# EAGLE design EC-TDS-PPM_V2-1 (EAGLE 7.5.0)
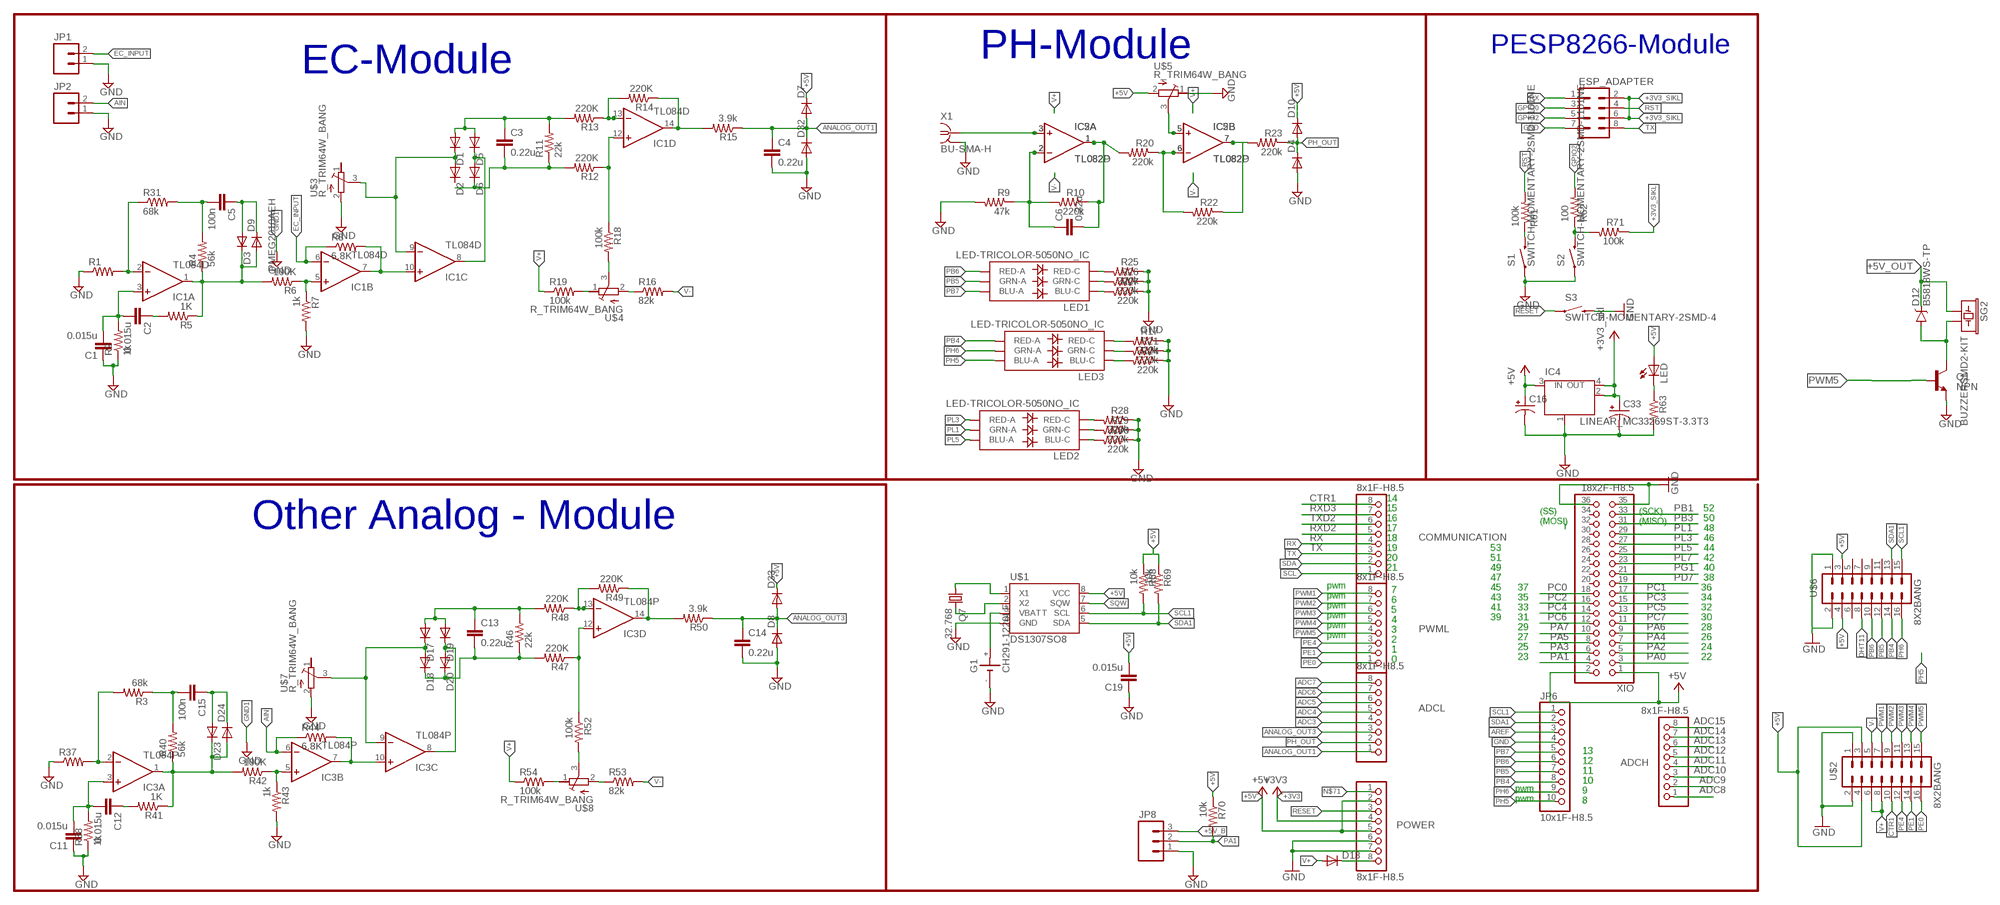
[diagram p0: schematic, sheet 1]

## Parts
ADCH  8x1F-H8.5  PINHD-1X8  [1X08]
ADCL  8x1F-H8.5  PINHD-1X8  [1X08]
C1  0.015u  C-EUC0603  [C0603]
C2  0.015u  C-EUC0603  [C0603]
C3  0.22u  C-EUC0603  [C0603]
C4  0.22u  C-EUC0603  [C0603]
C5  100n  C-EUC0603  [C0603]
C6  0.22u  C-EUC0603  [C0603]
C11  0.015u  C-EUC0603  [C0603]
C12  0.015u  C-EUC0603  [C0603]
C13  0.22u  C-EUC0603  [C0603]
C14  0.22u  C-EUC0603  [C0603]
C15  100n  C-EUC0603  [C0603]
C16  CPOL-USSMCC  [SMC_C]
C19  0.015u  C-EUC0603  [C0603]
C33  CPOL-USSMCC  [SMC_C]
COMMUNICATION  8x1F-H8.5  PINHD-1X8  [1X08]
D1  PMEG2010AEH  DIOD_SOT123F  [SOT123F]
D2  PMEG2010AEH  DIOD_SOT123F  [SOT123F]
D3  PMEG2010AEH  DIOD_SOT123F  [SOT123F]
D4  PMEG2010AEH  DIOD_SOT123F  [SOT123F]
D5  PMEG2010AEH  DIOD_SOT123F  [SOT123F]
D6  PMEG2010AEH  DIOD_SOT123F  [SOT123F]
D7  PMEG2010AEH  DIOD_SOT123F  [SOT123F]
D8  PMEG2010AEH  DIOD_SOT123F  [SOT123F]
D9  PMEG2010AEH  DIOD_SOT123F  [SOT123F]
D10  PMEG2010AEH  DIOD_SOT123F  [SOT123F]
D12  B5818WS-TP  DIODE-SCHOTTKY-BAT20J  [SOD-323]
D13  PMEG2010AEH  DIOD_SOT123F  [SOT123F]
D17  PMEG2010AEH  DIOD_SOT123F  [SOT123F]
D18  PMEG2010AEH  DIOD_SOT123F  [SOT123F]
D19  PMEG2010AEH  DIOD_SOT123F  [SOT123F]
D20  PMEG2010AEH  DIOD_SOT123F  [SOT123F]
D23  PMEG2010AEH  DIOD_SOT123F  [SOT123F]
D24  PMEG2010AEH  DIOD_SOT123F  [SOT123F]
D32  PMEG2010AEH  DIOD_SOT123F  [SOT123F]
D33  PMEG2010AEH  DIOD_SOT123F  [SOT123F]
ESP_ADAPTER  M04X2  [2X4]
G1  CH291-1220LF  [CH291-1220LF]
IC1  TL084D  [SO14]
IC2  TL082P  [DIL08]
IC3  TL084P  [DIL14]
IC4  LINEAR_MC33269ST-3.3T3  [LINEAR_SOT223]
IC5  TL082D  [SO08]
JP1  M025MM  [SCREWTERMINAL-5MM-2]
JP2  M025MM  [SCREWTERMINAL-5MM-2]
JP6  10x1F-H8.5  PINHD-1X10_ARD  [1X10]
JP8  M03PTH  [1X03]
LED  SPARKFUN_LED0603  [SPARKFUN_LED-0603]
LED1  LED-TRICOLOR-5050NO_IC  [LED-TRICOLOR-5050]
LED2  LED-TRICOLOR-5050NO_IC  [LED-TRICOLOR-5050]
LED3  LED-TRICOLOR-5050NO_IC  [LED-TRICOLOR-5050]
POWER  8x1F-H8.5  PINHD-1X8  [1X08]
PWML  8x1F-H8.5  PINHD-1X8  [1X08]
Q1  NPN  TRANSISTOR_NPNSOT23-3  [SOT23-3]
Q7  32.768  CRYTALTC38H  [TC38H]
R1  R-US_R0603  [R0603]
R2  1k  R-US_R0603  [R0603]
R3  68k  R-US_R0603  [R0603]
R4  56k  R-US_R0603  [R0603]
R5  1K  R-US_R0603  [R0603]
R6  100K  R-US_R0603  [R0603]
R7  1k  R-US_R0603  [R0603]
R8  6.8K  R-US_R0603  [R0603]
R9  47k  R-US_R0603  [R0603]
R10  220k  R-US_R0603  [R0603]
R11  22k  R-US_R0603  [R0603]
R12  220K  R-US_R0603  [R0603]
R13  220K  R-US_R0603  [R0603]
R14  220K  R-US_R0603  [R0603]
R15  3.9k  R-US_R0603  [R0603]
R16  82k  R-US_R0603  [R0603]
R17  220k  R-US_R0603  [R0603]
R18  100k  R-US_R0603  [R0603]
R19  100k  R-US_R0603  [R0603]
R20  220k  R-US_R0603  [R0603]
R21  220k  R-US_R0603  [R0603]
R22  220k  R-US_R0603  [R0603]
R23  220k  R-US_R0603  [R0603]
R24  220k  R-US_R0603  [R0603]
R25  220k  R-US_R0603  [R0603]
R26  220k  R-US_R0603  [R0603]
R27  220k  R-US_R0603  [R0603]
R28  220k  R-US_R0603  [R0603]
R29  220k  R-US_R0603  [R0603]
R30  220k  R-US_R0603  [R0603]
R31  68k  R-US_R0603  [R0603]
R37  R-US_R0603  [R0603]
R38  1k  R-US_R0603  [R0603]
R40  56k  R-US_R0603  [R0603]
R41  1K  R-US_R0603  [R0603]
R42  100K  R-US_R0603  [R0603]
R43  1k  R-US_R0603  [R0603]
R44  6.8K  R-US_R0603  [R0603]
R46  22k  R-US_R0603  [R0603]
R47  220K  R-US_R0603  [R0603]
R48  220K  R-US_R0603  [R0603]
R49  220K  R-US_R0603  [R0603]
R50  3.9k  R-US_R0603  [R0603]
R52  100k  R-US_R0603  [R0603]
R53  82k  R-US_R0603  [R0603]
R54  100k  R-US_R0603  [R0603]
R61  100k  R-US_R0603  [R0603]
R62  100  R-US_R0603  [R0603]
R63  SPARKFUN_RESISTOR0603-RES  [SPARKFUN_0603-RES]
R68  10k  R-US_R0603  [R0603]
R69  10k  R-US_R0603  [R0603]
R70  10k  R-US_R0603  [R0603]
R71  100k  R-US_R0603  [R0603]
S1  SWITCH-MOMENTARY-2SMD-1101NE  [TACTILE-SWITCH-1101NE]
S2  SWITCH-MOMENTARY-2SMD-1101NE  [TACTILE-SWITCH-1101NE]
S3  SWITCH-MOMENTARY-2SMD-4  [TACTILE_SWITCH_TALL]
SG2  BUZZERSMD2-KIT  [BUZZER-CCV-KIT]
U$1  DS1307SO8  [SO08]
U$2  8X2BANG  [8X2BANG]
U$3  R_TRIM64W_BANG  [RTRIM64W_BANG]
U$4  R_TRIM64W_BANG  [RTRIM64W_BANG]
U$5  R_TRIM64W_BANG  [RTRIM64W_BANG]
U$6  8X2BANG  [8X2BANG]
U$7  R_TRIM64W_BANG  [RTRIM64W_BANG]
U$8  R_TRIM64W_BANG  [RTRIM64W_BANG]
X1  BU-SMA-H  [BU-SMA-H]
XIO  18x2F-H8.5  PINHD-2X18  [2X18]

## Nets
+3V3: POWER.4
+3V3_SIKL: C33.+ ESP_ADAPTER.2 ESP_ADAPTER.6 IC4.2(OUT) IC4.4(OUT) R71.1 ; supply symbol labelled +3V3_sikl
+5V: C16.+ C19.2 D7.C D10.C D33.C IC4.3(IN) LED.A POWER.2 POWER.5 R68.1 R69.1 R70.1 U$1.8(VCC) U$2.3 U$2.4 U$5.2(E) U$6.3 U$6.4
+5V_B: JP8.3 XIO.1 XIO.2 ; supply symbol labelled +5V
+5V_OUT: D12.C SG2.+
ADC3: ADCL.4
ADC4: ADCL.5
ADC5: ADCL.6
ADC6: ADCL.7
ADC7: ADCL.8
ADC8: ADCH.1
ADC9: ADCH.2
ADC10: ADCH.3
ADC11: ADCH.4
ADC12: ADCH.5
ADC13: ADCH.6
ADC14: ADCH.7
ADC15: ADCH.8
AIN: IC3.6(B:-IN) JP2.2 R44.1
ANALOG_OUT1: ADCL.1 C4.1 D7.A D32.C R15.1
ANALOG_OUT3: ADCL.3 C14.1 D8.C D33.A R50.1
AREF: JP6.3
CTR1: COMMUNICATION.8 U$2.10
DHT11: U$6.8
EC_INPUT: IC1.6(B:-IN) JP1.2 R8.1
GND: C1.1 C4.2 C11.1 C14.2 C16.- C19.1 C33.- D4.A D8.A D32.A ESP_ADAPTER.7 G1.- IC4.1(GND/ADJ) JP1.1 JP2.1 JP6.4 JP8.1 POWER.6 POWER.7 Q1.2(E) R1.1 R2.1 R7.2 R9.2 R17.1 R21.1 R24.1 R25.1 R26.1 R27.1 R28.1 R29.1 R30.1 R37.1 R38.1 R43.2 R63.2 S1.1 S2.1 S3.B2 U$1.4(GND) U$2.1 U$2.2 U$3.2(E) U$6.1 U$6.2 U$7.2(E) X1.2 X1.3 X1.4 X1.5 XIO.35 XIO.36
GND1: U$5.1(A) ; supply symbol labelled GND
GPIO0: ESP_ADAPTER.3
GPIO2: ESP_ADAPTER.5 R62.2
N$1: IC1.2(A:-IN) R1.2 R31.1
N$2: C2.1 R5.2
N$3: C1.2 C2.2 IC1.3(A:+IN) R2.2
N$4: IC1.5(B:+IN) R6.1 R7.1
N$5: C5.2 R4.2 R31.2
N$6: R16.1 U$4.2(E)
N$7: D3.C D9.A IC1.1(A:OUT) R4.1 R5.1 R6.2
N$8: C5.1 D3.A D9.C
N$9: IC1.7(B:OUT) IC1.10(C:+IN) R8.2
N$10: R19.2 U$4.1(A)
N$11: IC1.13(D:-IN) R13.1 R14.2
N$12: C3.1 D1.A D5.A R11.2 R13.2
N$13: D1.C D2.A IC1.9(C:-IN) U$3.3(S)
N$14: C3.2 D6.C R11.1 R12.2
N$15: D5.C D6.A IC1.8(C:OUT)
N$16: IC1.12(D:+IN) R12.1 R18.1
N$17: IC1.14(D:OUT) R14.1 R15.2
N$18: R18.2 U$4.3(S)
N$19: IC2.5(B:+IN) IC5.5(B:+IN) U$5.3(S)
N$20: IC2.6(B:-IN) IC5.6(B:-IN) R20.1 R22.2
N$21: C6.1 IC2.2(A:-IN) IC5.2(A:-IN) R9.1 R10.2
N$22: C6.2 IC2.1(A:OUT) IC5.1(A:OUT) R10.1 R20.2
N$23: IC2.7(B:OUT) IC5.7(B:OUT) R22.1 R23.2
N$24: IC2.3(A:+IN) IC5.3(A:+IN) X1.1
N$25: LED3.5(RED-C) R17.2
N$26: LED3.6(GRN-C) R21.2
N$27: LED2.5(RED-C) R28.2
N$28: LED2.6(GRN-C) R29.2
N$29: LED2.4(BLU-C) R30.2
N$30: LED3.4(BLU-C) R24.2
N$31: LED1.5(RED-C) R25.2
N$32: LED1.6(GRN-C) R26.2
N$33: LED1.4(BLU-C) R27.2
N$36: D12.A Q1.3(C) SG2.-
N$37: IC3.2(A:-IN) R3.2 R37.2
N$38: C11.2 C12.2 IC3.3(A:+IN) R38.2
N$39: C15.2 R3.1 R40.2
N$40: D23.C D24.A IC3.1(A:OUT) R40.1 R41.1 R42.2
N$41: C12.1 R41.2
N$42: IC3.5(B:+IN) R42.1 R43.1
N$43: IC3.7(B:OUT) IC3.10(C:+IN) R44.2
N$44: C13.1 D17.A D19.A R46.2 R48.2
N$45: D17.C D18.A IC3.9(C:-IN) U$7.3(S)
N$46: C13.2 D18.C D20.C R46.1 R47.2
N$47: D19.C D20.A IC3.8(C:OUT)
N$48: IC3.13(D:-IN) R48.1 R49.2
N$49: IC3.12(D:+IN) R47.1 R52.1
N$50: IC3.14(D:OUT) R49.1 R50.2
N$51: C15.1 D23.A D24.C
N$52: R53.1 U$8.2(E)
N$53: R54.2 U$8.1(A)
N$54: R52.2 U$8.3(S)
N$55: D13.C POWER.8
N$62: R61.1 S1.2
N$63: R62.1 R71.2 S2.2
N$64: LED.C R63.1
N$68: Q7.1 U$1.1(X1)
N$69: Q7.2 U$1.2(X2)
N$71: POWER.1
N$72: G1.+ U$1.3(VBATT)
PA0: XIO.3
PA1: JP8.2 R70.2 XIO.4
PA2: XIO.5
PA3: XIO.6
PA4: XIO.7
PA5: XIO.8
PA6: XIO.9
PA7: XIO.10
PB1: XIO.33
PB3: XIO.31
PB4: JP6.8 LED3.2(RED-A) U$6.14
PB5: JP6.7 LED1.1(GRN-A) U$6.12
PB6: JP6.6 LED1.2(RED-A) U$6.10
PB7: JP6.5 LED1.3(BLU-A)
PC0: XIO.18
PC1: XIO.17
PC2: XIO.16
PC3: XIO.15
PC4: XIO.14
PC5: XIO.13
PC6: XIO.12
PC7: XIO.11
PD7: XIO.19
PE0: PWML.1 U$2.16
PE1: PWML.2 U$2.14
PE4: PWML.3 U$2.12
PG1: XIO.21
PH5: JP6.10 LED3.3(BLU-A)
PH6: JP6.9 LED3.1(GRN-A) U$6.16
PH_OUT: ADCL.2 D4.C D10.A R23.1
PL1: LED2.1(GRN-A) XIO.29
PL3: LED2.2(RED-A) XIO.27
PL5: LED2.3(BLU-A) XIO.25
PL7: XIO.23
PWM1: PWML.8 U$2.7
PWM2: PWML.7 U$2.9
PWM3: PWML.6 U$2.11
PWM4: PWML.5 U$2.13
PWM5: PWML.4 Q1.1(B) U$2.15
RESET: POWER.3 S3.A2
RST: ESP_ADAPTER.4 R61.2
RX: COMMUNICATION.4 ESP_ADAPTER.1
RXD2: COMMUNICATION.5
RXD3: COMMUNICATION.7
SCL: COMMUNICATION.1
SCL1: JP6.1 R68.2 U$1.6(SCL) U$6.15
SDA: COMMUNICATION.2
SDA1: JP6.2 R69.2 U$1.5(SDA) U$6.13
SQW: U$1.7(SQW)
TX: COMMUNICATION.3 ESP_ADAPTER.8
TXD2: COMMUNICATION.6
V+: D13.A R19.1 R54.1 U$2.6 U$2.8
V-: R16.2 R53.2 U$2.5
Unconnected: D2.C U$3.1(A) U$6.5 U$6.6 U$6.7 U$6.9 U$6.11 U$7.1(A) XIO.20 XIO.22 XIO.24 XIO.26 XIO.28 XIO.30 XIO.32 XIO.34

## Notes on the sheet
- PH-Module | PESP8266-Module
- EC-Module
- 14
- 15 | (SS) | (SCK) | 52
- 16 | (MOSI) | (MISO) | 50
- Other Analog - Module | 17 | 48
- 18 | 46
- 19 | 53 | 44
- 20 | 51 | 42
- 21 | 49 | 40
- 47 | 38
- pwm | 45 | 37 | 36
- 7
- pwm | 43 | 35 | 34
- 6
- pwm | 41 | 33 | 32
- 5
- pwm | 39 | 31 | 30
- 4
- pwm | 29 | 28
- 3
- pwm | 27 | 26
- 2
- 1 | 25 | 24
- 0 | 23 | 22
- 13
- 12
- 11
- 10
- pwm | 9
- pwm | 8

## Power pins joined to a net without a drawn wire
V+: IC1.4(P:V+) IC2.8(P:V+) IC3.4(P:V+) IC5.8(P:V+)
V-: IC1.11(P:V-) IC2.4(P:V-) IC3.11(P:V-) IC5.4(P:V-)

## Library data of the parts
ADCH ADCL COMMUNICATION POWER PWML = SmartPrj:PINHD-1X8: PIN HEADER
C1-C6 C11-C15 C19 = resistor:C-EU: CAPACITOR, European symbol
C16 C33 = rcl:CPOL-US: POLARIZED CAPACITOR, American symbol
D1-D10 D13 D17-D20 D23 D24 D32 D33 = Enleka_Diode:DIOD_SOT123F; PARTNO: PMEG2010AEH,115
D12 = SparkFun-DiscreteSemi:DIODE-SCHOTTKY: Schottky diodes in SFE's production catalog BAT20J 1A 23V 0.62Vf RB751 120mA 40V 0.37Vf PMEG4005EJ 0.5A 40V 0.42Vf MBRA140 1A 40V 0.5Vf B340A 3A 40V SMA; PARTNO: BAT20JFILM; PROD_ID: DIO-11623; VALUE: BAT20J
ESP_ADAPTER = SparkFun-Connectors:M04X2: .1" header, two rows of four.
G1 = battery:CH291-1220LF: Battery Holder, SMT, 12mm multicomp PART NO. CH291-1220LF Source: Data sheet <http://www.farnell.com/datasheets/1505860.pdf>
IC1 IC3 = linear:TL084: OP AMP
IC2 IC5 = linear:TL082: OP AMP Data sheet <http://www.ti.com/lit/ds/symlink/tl084a . pdf>; DATA_SHEET: <a href="http://www.ti.com/lit/ds/symlink/tl084a.pdf"> Data sheet </a>
IC4 = Robotech_Other:LINEAR_MC33269ST*: Adjustable Output Low Dropout Voltage Regulator 800 mA Source: http://www.onsemi.com/pub/Collateral/MC33269-D.PDF
JP1 JP2 = SparkFun-Connectors:M02: Standard 2-pin 0.1" header. Use with - straight break away headers ( PRT-00116) - right angle break away headers (PRT-00553) - swiss pins (PRT-00743) - machine pins (PRT-00117) - female headers (PRT-00115) Molex polarized connector foot print use with: PRT-08233 with associated crimp pins and housings. 2.54_SCREWTERM for use with PRT-10571. 3.5mm Screw Terminal footprints for PRT-08084 5mm Screw Terminal footprints for use with PRT-08432; STOREFRONT_ID: PRT-08432
JP6 = SmartPrj:PINHD-1X10_ARD: PIN HEADER
JP8 = SparkFun-Connectors:M03: Header 3 Standard 3-pin 0.1" header. Use with straight break away headers (SKU : PRT-00116), right angle break away headers (PRT-00553), swiss pins (PRT-00743), machine pins (PRT-00117), and female headers (PRT-00115). Molex polarized connector foot print use with SKU : PRT-08232 with associated crimp pins and housings.
LED = Robotech RLC of Chung:SPARKFUN_LED: LEDs Standard schematic elements and footprints for 5mm, 3mm, 1206, and 0603 sized LEDs. 5mm - Spark Fun Electronics SKU : COM-00529 (and others)
LED1-LED3 = SparkFun-LED:LED-TRICOLOR-5050
Q1 = SparkFun-DiscreteSemi:TRANSISTOR_NPN: Generic NPN BJT MMBT2222A - TRANS-08049 (SOT-23, 1A 40V) MPSA42 - TRANS-09116 (SOT-23, 500mA 300V) MMBT5088LT1G - TRANS-11160 (SOT-23, 50 mA 30V) BC547 - COM-08928 <http://www.sparkfun.com/products/8928> (TO-92 45V 100mA) (1.Collector 2.Base 3.Emitter) 2N3904 - COM-00521 <http://www.sparkfun.com/products/521> (TO-92 40V 200mA) (1.Emitter 2.Base 3.Collector) P2N2222A - COM-12852 <http://www.sparkfun.com/products/12852> (TO-92 40V 600mA) (1.Collector 2.Base 3.Emitter); PARTNO: 2SD1048-6-TB-E; PROD_ID: TRANS-08049
Q7 = crystal:CRYTAL: CRYSTAL
R1-R31 R37 R38 R40-R44 R46-R50 R52-R54 R61 R62 R68-R71 = resistor:R-US_: RESISTOR, American symbol
R63 = Robotech_RCL:SPARKFUN_RESISTOR: Resistor Basic schematic elements and footprints for 0603, 1206, and PTH resistors.
S1 S2 = SparkFun-Electromechanical:SWITCH-MOMENTARY-2: Various NO switches- pushbuttons, reed, etc; PROD_ID: SWCH-00815
S3 = SparkFun-Electromechanical:SWITCH-MOMENTARY-2: Various NO switches- pushbuttons, reed, etc; PROD_ID: SWCH-11966
SG2 = buzzer-greentura:BUZZER: Buzzer 12mm Spark Fun Electronics SKU : Comp-Buzzer
U$1 = SparkFun-FreqCtrl:DS1307: I2C real-time clock with battery backup.
U$2 U$6 = SparkFun-Connectors:8X2BANG
U$3-U$5 U$7 U$8 = rtrim:R_TRIM64W_BANG
X1 = con-coax:BU-SMA-H: FEMALE SMA CONNECTOR Radiall; OC_FARNELL: unknown; OC_NEWARK: unknown
XIO = SmartPrj:PINHD-2X18: PIN HEADER

## Net classes
0 default: width 0.178 mm, drill 0.381 mm, clearance 0.178 mm
1 power: width 0.15 mm, drill 0.2 mm, clearance 0.152 mm
2 gnd: width 0.305 mm, drill 0.406 mm, clearance 0.203 mm
3 power usb: width 0.508 mm, drill 0.406 mm, clearance 0.203 mm

## Board
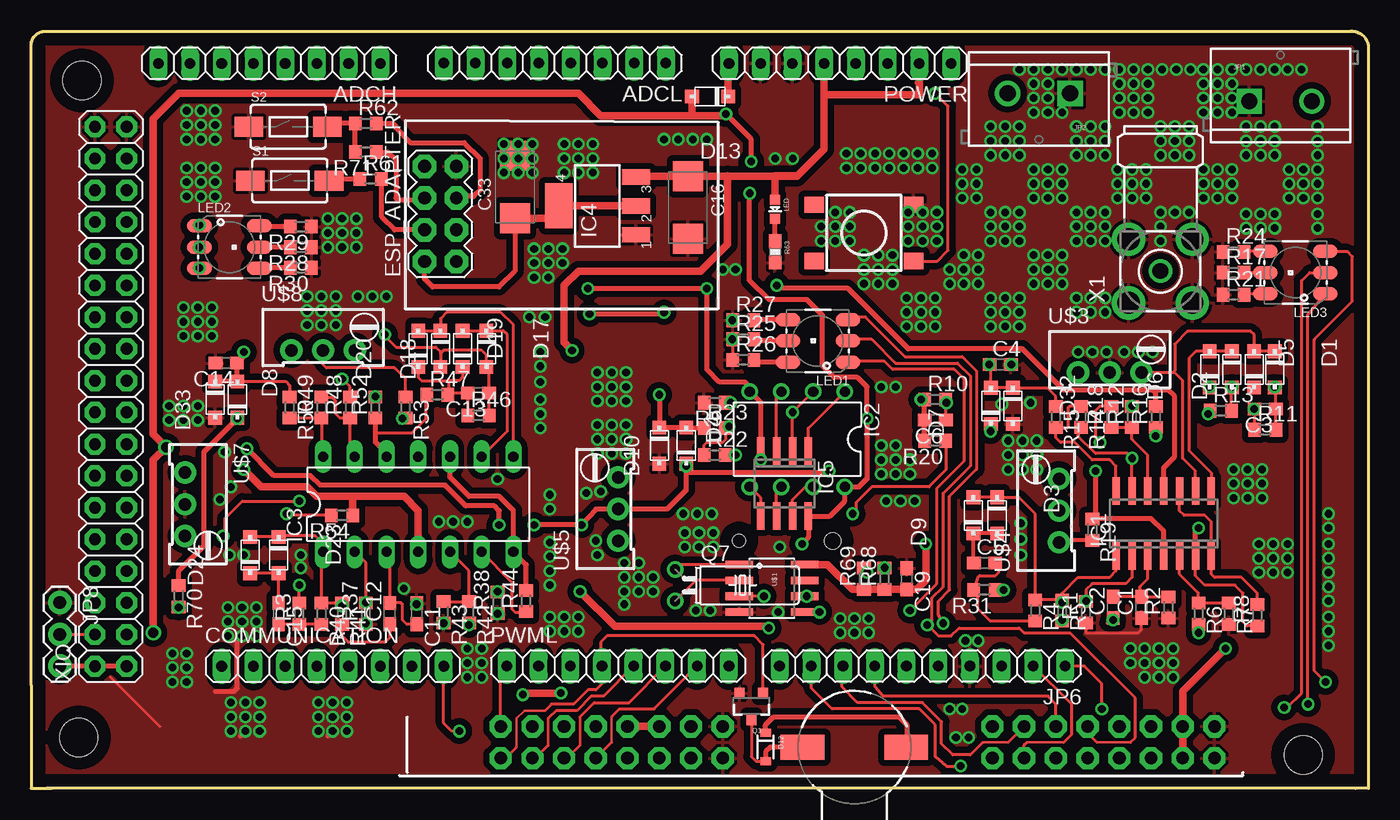
[diagram p1: board, top side]
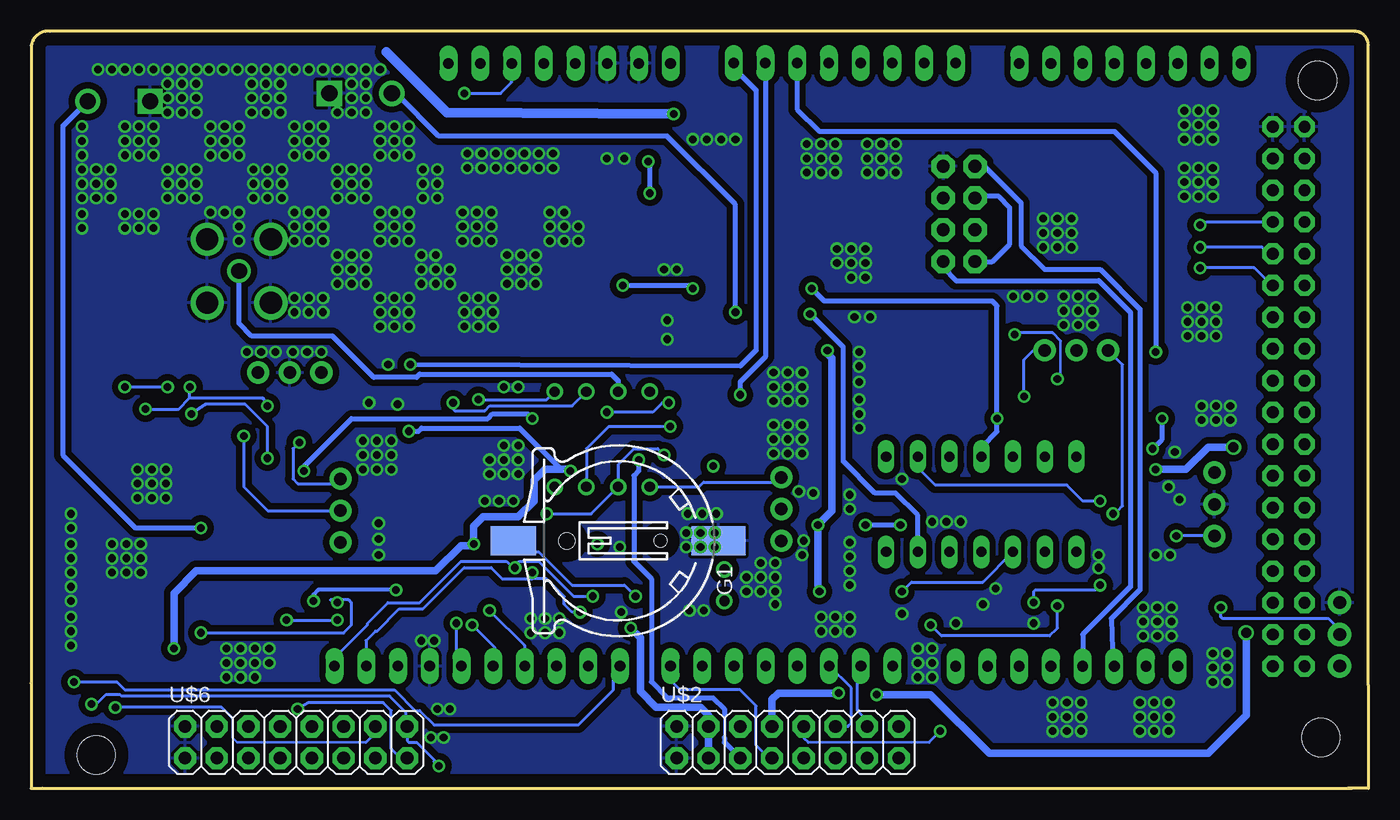
[diagram p2: board, bottom side, seen from below]

Size 107.06 x 60.6 mm. Coordinates in mm from the lower left corner, seen from the top.
Outline: 107.06,8.41 107.06,59.46 arc90 105.55,60.58 1.09,60.58 arc90 0,59.49 0,8.26
Outline: 106.15,0.01 1.27,0.01
Outline: 107.06,8.38 107.06,0 106.05,0
Outline: 0,8.25 0,0 1.65,0
Copper layers (1*16): Top 0.035mm / dielectric 1.5mm / Bottom 0.035mm
Design rules "default *": minimum track width 8mil, minimum drill 24mil, track to track 10mil, track to pad 10mil, pad to pad 10mil, via to via 10mil, smd to smd 8mil, copper to edge 40mil, drill to drill 8mil, minimum pad ring 10mil, minimum via ring 8mil, stop-mask expansion 4mil, vias tented up to drill 100mil, thermal gap 10mil
Holes 3.05 mm at 101.85,2.67 3.81,4.06 4.06,56.64

### Footprints (pad centres in the part's own frame; a part is rotated, then mirrored left to right if it is on the bottom)
1X08 = drill 0.85 pad 1.422 long: 1 -8.89,0; 2 -6.35,0; 3 -3.81,0; 4 -1.27,0; 5 1.27,0; 6 3.81,0; 7 6.35,0; 8 8.89,0
C0603 = smd 1.1 x 1: 1 -0.85,0; 2 0.85,0
SMC_C = smd 2.4 x 2.4: + -2.5,0; - 2.5,0
SOT123F = smd 1.1 x 1.1: A 1.45,0; C -1.45,0
SOD-323 = smd 0.63 x 0.83: A 1.15,0; C -1.15,0
2X4 = drill 1.016 pad 1.88 octagon: 1 -3.81,-1.27; 2 -3.81,1.27; 3 -1.27,-1.27; 4 -1.27,1.27; 5 1.27,-1.27; 6 1.27,1.27; 7 3.81,-1.27; 8 3.81,1.27
CH291-1220LF = smd 2.3 x 3.66: + 0,-2.296 | smd 2.3 x 4.3: - 0,14.146 | hole 1.3: 0,2 | hole 1: 0,9.5
SO14 = smd 0.6 x 2.2: 1 -3.81,-2.6; 2 -2.54,-2.6; 3 -1.27,-2.6; 4 0,-2.6; 5 1.27,-2.6; 6 2.54,-2.6; 7 3.81,-2.6; 8 3.81,2.6; 9 2.54,2.6; 10 1.27,2.6; 11 0,2.6; 12 -1.27,2.6; 13 -2.54,2.6; 14 -3.81,2.6
DIL08 = drill 0.813 pad 1.27: 1 -3.81,-3.81; 2 -1.27,-3.81; 3 1.27,-3.81; 4 3.81,-3.81; 5 3.81,3.81; 6 1.27,3.81; 7 -1.27,3.81; 8 -3.81,3.81
DIL14 = drill 0.813 long: 1 -7.62,-3.81; 2 -5.08,-3.81; 3 -2.54,-3.81; 4 0,-3.81; 5 2.54,-3.81; 6 5.08,-3.81; 7 7.62,-3.81; 8 7.62,3.81; 9 5.08,3.81; 10 2.54,3.81; 11 0,3.81; 12 -2.54,3.81; 13 -5.08,3.81; 14 -7.62,3.81
LINEAR_SOT223 = smd 1.219 x 2.235: 1 -2.311,-3.099; 2 0,-3.099; 3 2.311,-3.099 | smd 3.6 x 2.2: 4 0,3.099
SO08 = smd 0.6 x 2.2: 1 -1.905,-2.6; 2 -0.635,-2.6; 3 0.635,-2.6; 4 1.905,-2.6; 5 1.905,2.6; 6 0.635,2.6; 7 -0.635,2.6; 8 -1.905,2.6
SCREWTERMINAL-5MM-2 = drill 1.3 pad 2.032 square: 1 0,0 | drill 1.3 pad 2.032: 2 5,0
1X10 = drill 0.85 pad 1.422 long: 1 -11.43,0; 2 -8.89,0; 3 -6.35,0; 4 -3.81,0; 5 -1.27,0; 6 1.27,0; 7 3.81,0; 8 6.35,0; 9 8.89,0; 10 11.43,0
1X03 = drill 1.016 pad 1.88: 1 0,0; 2 2.54,0; 3 5.08,0
SPARKFUN_LED-0603 = smd 0.8 x 0.8: A 0,-0.75; C 0,0.75
LED-TRICOLOR-5050 = smd 2 x 1.1: 1 -2.4,1.7; 2 -2.4,0; 3 -2.4,-1.7; 4 2.4,-1.7; 5 2.4,0; 6 2.4,1.7
SOT23-3 = smd 0.8 x 0.9: 1 -0.95,-1; 2 0.95,-1; 3 0,1.1
TC38H = drill 0.813: 1 -1.27,0; 2 1.27,0
R0603 = smd 1 x 1.1: 1 -0.85,0; 2 0.85,0
SPARKFUN_0603-RES = smd 1.1 x 1: 1 -0.85,0; 2 0.85,0
TACTILE-SWITCH-1101NE = smd 2.3 x 1.6: 1 -3.15,0; 2 3.15,0
TACTILE_SWITCH_TALL = smd 1.55 x 1.3: A1 -3.975,-2.25; A2 3.975,-2.25; B1 -3.975,2.25; B2 3.975,2.25
BUZZER-CCV-KIT = smd 3.5 x 2: + 4.15,0; - -4.15,0
SO08' = smd 0.61 x 2.21: 1 -1.905,-2.616; 2 -0.635,-2.616; 3 0.635,-2.616; 4 1.905,-2.616; 5 1.905,2.616; 6 0.635,2.616; 7 -0.635,2.616; 8 -1.905,2.616
8X2BANG = drill 1.016 pad 1.778 octagon: 1 0,0; 2 0,2.54; 3 2.54,0; 4 2.54,2.54; 5 5.08,0; 6 5.08,2.54; 7 7.62,0; 8 7.62,2.54; 9 10.16,0; 10 10.16,2.54; 11 12.7,0; 12 12.7,2.54; 13 15.24,0; 14 15.24,2.54; 15 17.78,0; 16 17.78,2.54
RTRIM64W_BANG = drill 1 pad 1.778: 1 2.54,-2.54; 2 2.54,0; 3 2.54,2.54
BU-SMA-H = drill 1.27: 1 0,0 | drill 1.778: 2 -2.55,2.55; 3 2.55,2.55; 4 2.55,-2.55; 5 -2.55,-2.55
2X18 = drill 0.95 pad 1.676 octagon: 1 -21.59,-1.27; 2 -21.59,1.27; 3 -19.05,-1.27; 4 -19.05,1.27; 5 -16.51,-1.27; 6 -16.51,1.27; 7 -13.97,-1.27; 8 -13.97,1.27; 9 -11.43,-1.27; 10 -11.43,1.27; 11 -8.89,-1.27; 12 -8.89,1.27; 13 -6.35,-1.27; 14 -6.35,1.27; 15 -3.81,-1.27; 16 -3.81,1.27; 17 -1.27,-1.27; 18 -1.27,1.27; 19 1.27,-1.27; 20 1.27,1.27; 21 3.81,-1.27; 22 3.81,1.27; 23 6.35,-1.27; 24 6.35,1.27; 25 8.89,-1.27; 26 8.89,1.27; 27 11.43,-1.27; 28 11.43,1.27; 29 13.97,-1.27; 30 13.97,1.27; 31 16.51,-1.27; 32 16.51,1.27; 33 19.05,-1.27; 34 19.05,1.27; 35 21.59,-1.27; 36 21.59,1.27

### Placement (x,y rotation side)
ADCH  19.06,58.03 180 top
ADCL  41.92,58.05 180 top
C1  88.9,14.48 90 top
C2  86.61,14.48 90 top
C3  98.81,30.35 180 top
C4  77.6,33.91 0 top
C5  76.33,18.03 0 top
C6  72.39,29.46 180 top
C11  30.86,13.97 270 top
C12  28.7,13.97 90 top
C13  35.81,31.62 180 top
C14  15.62,34.04 180 top
C15  19.81,13.97 270 top
C16  52.58,46.48 270 top
C19  70.1,16.76 270 top
C33  38.73,48.13 90 top
COMMUNICATION  24.14,9.77 0 top
D1  99.57,33.53 270 top
D2  97.92,33.53 90 top
D3  77.34,21.84 270 top
D4  50.29,27.43 270 top
D5  96.14,33.53 270 top
D6  94.36,33.53 90 top
D7  76.83,30.61 90 top
D8  14.73,31.12 270 top
D9  75.44,21.84 90 top
D10  52.45,27.43 90 top
D12  58.8,3.3 270 top
D13  54.36,55.37 180 top
D17  36.45,35.18 270 top
D18  34.54,35.18 90 top
D19  32.77,35.18 270 top
D20  30.99,35.18 90 top
D23  19.81,18.67 270 top
D24  17.53,18.67 90 top
D32  78.61,30.61 270 top
D33  16.51,31.12 90 top
ESP_ADAPTER  32.77,45.97 90 top
G1  66.17,19.81 270 bottom
IC1  90.68,21.21 0 top
IC2  61.34,27.94 180 top
IC3  30.99,22.73 0 top
IC4  45.34,46.61 90 top
IC5  60.33,24.38 180 top
JP1  97.54,54.99 0 top
JP2  83.18,55.63 180 top
JP6  71.35,9.78 180 top
JP8  2.29,14.86 270 top
LED  59.56,46.35 180 top
LED1  62.99,35.81 180 top
LED2  15.88,43.31 0 top
LED3  101.22,41.27 180 top
POWER  64.76,58.03 180 top
PWML  46.98,9.79 0 top
Q1  57.66,6.6 180 top
Q7  51.56,16.26 270 top
R1  84.45,14.1 90 top
R2  91.06,14.48 90 top
R3  21.46,13.97 90 top
R4  80.39,14.22 270 top
R5  82.55,14.22 270 top
R6  93.47,13.97 270 top
R7  95.88,13.97 270 top
R8  98.17,13.84 90 top
R9  54.74,30.86 180 top
R10  72.39,31.12 0 top
R11  98.81,28.7 0 top
R12  88.14,29.72 90 top
R13  95.25,30.23 0 top
R14  84.07,29.72 270 top
R15  82.04,29.72 270 top
R16  90.04,29.72 90 top
R17  96.27,41.27 0 top
R18  86.49,29.72 90 top
R19  84.96,20.7 270 top
R20  72.39,27.81 180 top
R21  96.27,39.5 0 top
R22  54.74,26.67 0 top
R23  54.74,28.83 0 top
R24  96.27,42.93 0 top
R25  57.02,35.94 0 top
R26  57.02,34.29 0 top
R27  57.02,37.46 0 top
R28  21.59,43.31 180 top
R29  21.59,44.96 180 top
R30  21.59,41.66 180 top
R31  76.33,15.87 180 top
R37  26.8,13.97 90 top
R38  37.34,14.86 90 top
R40  23.24,13.97 270 top
R41  24.89,13.97 270 top
R42  35.05,14.1 270 top
R43  33.02,14.1 270 top
R44  39.62,14.99 90 top
R46  35.81,29.85 0 top
R47  32.51,31.5 0 top
R48  25.53,30.48 90 top
R49  23.24,30.48 90 top
R50  20.7,30.48 270 top
R52  27.56,30.48 90 top
R53  29.97,30.48 270 top
R54  24.89,21.84 180 top
R61  27.18,48.77 0 top
R62  26.8,53.21 0 top
R63  59.56,42.93 270 top
R68  68.33,16.76 90 top
R69  66.67,16.76 90 top
R70  11.81,15.37 270 top
R71  26.8,50.93 180 top
S1  20.7,48.64 0 top
S2  20.57,52.96 0 top
S3  66.67,44.45 0 top
SG2  65.91,3.3 0 top
U$1  DS1307SO8  [SO08']  59.31,16 270 top
U$2  55.37,2.41 0 bottom
U$3  86.36,35.81 270 top
U$4  79.76,22.23 0 top
U$5  44.45,22.35 0 top
U$6  94.74,2.41 0 bottom
U$7  14.86,22.73 180 top
U$8  23.37,37.59 270 top
X1  90.42,41.4 90 top
XIO  6.38,31.36 90 top

### Tracks (layer width: path | path; a pad name or v marks a point on that pad's centre or on a via)
+3V3_SIKL
  Top 0.381: C33.+ 38.73,41.4 37.47,40.13 32.13,40.13 31.5,40.77 ESP_ADAPTER.2 | R71.1 28.57,50.93 29.21,50.29 29.21,47.24 29.34,47.12 31.37,47.12 ESP_ADAPTER.6 | IC4.4 42.24,45.92 42.04,45.72
  Top 0.61: IC4.2 IC4.4 | C33.+ 42.84,45.63 43.05,45.85 42.32,45.85 42.24,45.92
  Bottom 0.381: ESP_ADAPTER.2 30.1,42.16 28.7,43.56 28.7,46.48 29.59,47.37 31.37,47.37 ESP_ADAPTER.6
+5V  (via drill 0.61)
  Top 0.254: D10.C v52.45,25.78
  Top 0.381: v40.26,21.08 v44.07,21.08 45.21,22.35 U$5.2 50.93,22.35 52.45,23.88 v52.45,25.78 | v17.27,27.18 19.43,25.02 22.35,25.02 23.11,24.26 33.15,24.26 34.8,22.61 37.08,22.61 37.47,22.23 v37.47,21.08 | D33.C v16.51,29.59 13.84,26.92 13.84,19.43 11.81,17.4 R70.1 | v63.88,25.4 63.88,25.53 63.63,25.27 52.53,25.27 D10.C | D7.C v76.83,28.58
  Top 0.61: LED.A 59.56,49.02 61.34,49.02 | C16.+ 48.09,48.98 47.88,48.77 48.29,48.77 IC4.3 | POWER.5 63.49,55.37 | 63.49,55.37 63.49,51.17 61.34,49.02 | POWER.2 71.11,56.52 | 71.11,56.52 71.11,56.12 71.12,55.5 63.61,55.5 63.49,55.37 | 71.05,56.45 71.11,56.52 | C16.+ 61.3,48.98 61.34,49.02 | C16.+ 55.71,48.98 55.75,49.02 55.75,43.56 53.59,41.4 43.82,41.4 42.67,40.26 42.67,35.69 v43.31,35.05 | U$1.8 63.75,17.91 65.75,15.91 R69.1 R68.1 C19.2 70.91,15.91 71.63,16.64 v71.63,19.56 | v95.63,11.18 92.2,7.75 U$6.4 U$6.3 | v59.05,12.83 58.93,12.83 58.67,12.95 46.74,12.95 v43.94,15.75
  Bottom 0.381: v40.26,21.08 v37.47,21.08 | v17.27,27.18 16.51,27.94 v16.51,29.59 | v76.83,28.58 76.07,28.58 75.82,28.83 67.94,28.83 64.64,25.53 v63.88,25.4
  Bottom 0.61: v43.94,15.75 44.07,15.62 v44.07,21.08 42.93,22.23 42.93,34.42 43.31,34.8 v43.31,35.05 | 63.75,25.4 v63.88,25.4 64.01,25.53 65.91,25.53 66.8,24.64 66.8,22.99 68.07,21.72 70.87,21.72 71.63,20.96 v71.63,19.56 71.75,19.43 72.64,19.43 74.68,17.4 93.85,17.4 95.63,15.62 v95.63,11.18 | v59.05,12.83 58.29,12.06 58.29,7.75 57.02,6.48 53.47,6.48 52.83,5.84 U$2.4 U$2.3
+5V_B
  Top 0.381: XIO.1 XIO.2 2.3,9.77 JP8.3
+5V_OUT
  Top 0.381: D12.C 58.8,5.08 59.44,5.71 69.47,5.71 70.1,5.08 70.1,3.34 SG2.+
AIN  (via drill 0.61)
  Top 0.254: IC3.6 38.48,16.51 38.48,14.35 38.73,14.1 39.59,14.1 R44.1
  Top 0.381: v44.7,37.97 50.55,37.97 v50.67,38.1
  Bottom 0.381: IC3.6 36.07,21.84 37.85,23.62 39.5,23.62 42.04,26.16 42.04,35.31 v44.7,37.97 | v50.67,38.1 50.67,46.74 56.13,52.2 74.42,52.2 77.72,55.5 77.93,55.5 JP2.2
ANALOG_OUT1  (via drill 0.61)
  Top 0.254: C4.1 76.83,33.82 D7.A D32.C 78.67,32 81.41,32 82.04,31.37 R15.1
  Top 0.381: v76.71,33.91 C4.1
  Bottom 0.381: ADCL.1 50.81,57.67 49.02,55.88 49.02,35.05 50.29,33.78 v76.71,33.91
ANALOG_OUT3  (via drill 0.61)
  Top 0.254: D33.A 20.39,32.56 20.7,32.26 R50.1
  Top 0.381: 17.02,35.01 v17.02,34.92 17.02,34.58 C14.1 16.51,34 D33.A D8.C
  Bottom 0.381: ADCL.3 45.73,54.37 43.94,52.58 20.32,52.58 17.02,49.28 v17.02,34.92
CTR1  (via drill 0.61)
  Top 0.254: v34.29,4.57 33.66,4.57 33.02,5.21 33.02,9.75 COMMUNICATION.8
  Bottom 0.203: 44.83,3.68 35.18,3.68
  Bottom 0.254: U$2.10 45.21,4.06 44.83,3.68 | 35.18,3.68 v34.29,4.57
EC_INPUT  (via drill 0.61)
  Top 0.254: R8.1 97.37,12.99 97.03,13.33 97.03,15.62 96.39,16.26 93.98,16.26 93.22,17.02 IC1.6
  Top 0.381: IC1.6 93.22,20.57 v93.47,20.83
  Bottom 0.381: v93.47,20.83 98.68,20.83 104.52,26.67 104.52,53.01 JP1.2
GND  (via drill 0.61)
  Top 0.254: R26.1 R25.1 | 84.45,12.45 R1.1 84.45,12.57 84.58,12.45 88.65,12.45 88.9,12.7 C1.1 | 10.29,4.95 6.35,8.89
  Top 0.381: 14.73,7.75 16.26,7.75 16.51,8 16.51,11.81 v16.89,12.19 | 16.76,4.19 v17.14,4.57 | 23.75,4.19 v24.13,4.57
  other vias: 60.96,50.42 59.56,50.42 54.1,51.94 52.96,51.94 51.82,51.94 50.67,51.94 72.14,50.8 70.99,50.8 69.85,50.8 68.71,50.8 67.56,50.8 66.42,50.8 65.28,50.8 72.14,49.66 70.99,49.66 69.85,49.66 68.71,49.66 67.56,49.66 66.42,49.66 65.28,49.66 44.96,49.28 43.82,49.28 42.67,49.28 44.96,50.42 43.82,50.42 42.67,50.42 40.13,49.28 38.99,49.28 37.85,49.28 40.13,50.42 38.99,50.42 37.85,50.42 13.34,29.46 12.19,29.46 11.05,29.46 13.34,30.61 12.19,30.61 11.05,30.61 14.73,49.66 13.59,49.66 12.45,49.66 14.73,47.37 13.59,47.37 12.45,47.37 14.73,48.51 13.59,48.51 12.45,48.51 14.73,51.94 13.59,51.94 12.45,51.94 14.73,53.09 13.59,53.09 12.45,53.09 14.48,38.48 13.34,38.48 12.19,38.48 14.48,36.2 13.34,36.2 12.19,36.2 14.48,37.34 13.34,37.34 12.19,37.34 26.04,45.59 24.89,45.59 23.75,45.59 26.04,43.31 24.89,43.31 23.75,43.31 26.04,44.45 24.89,44.45 23.75,44.45 47.62,29.08 46.48,29.08 45.34,29.08 47.62,26.8 46.48,26.8 45.34,26.8 47.62,27.94 46.48,27.94 45.34,27.94 98.55,25.53 97.41,25.53 96.27,25.53 98.55,23.24 97.41,23.24 96.27,23.24 98.55,24.38 97.41,24.38 96.27,24.38 100.58,19.56 99.44,19.56 98.3,19.56 100.58,17.27 99.44,17.27 100.58,18.42 99.44,18.42 98.3,18.42 85.98,39.24 84.84,39.24 83.69,39.24 85.98,38.1 84.84,38.1 83.69,38.1 82.55,42.67 81.41,42.67 80.26,42.67 82.55,40.39 81.41,40.39 80.26,40.39 82.55,41.53 81.41,41.53 80.26,41.53 79.12,46.1 77.98,46.1 76.83,46.1 79.12,43.81 77.98,43.81 76.83,43.81 79.12,44.96 77.98,44.96 76.83,44.96 75.69,49.53 74.55,49.53 75.69,47.24 74.55,47.24 75.69,48.39 74.55,48.39 75.82,42.67 74.68,42.67 75.82,40.39 74.68,40.39 73.53,40.39 75.82,41.53 74.68,41.53 73.53,41.53 79.12,39.24 77.98,39.24 76.83,39.24 79.12,36.96 77.98,36.96 76.83,36.96 79.12,38.1 77.98,38.1 76.83,38.1 85.98,46.1 84.84,46.1 83.69,46.1 85.98,43.81 84.84,43.81 83.69,43.81 85.98,44.96 84.84,44.96 83.69,44.96 82.55,49.53 81.41,49.53 80.26,49.53 82.55,47.24 81.41,47.24 80.26,47.24 82.55,48.39 81.41,48.39 80.26,48.39 99.57,45.97 98.42,45.97 97.28,45.97 99.57,44.83 98.42,44.83 97.28,44.83 96.14,49.53 95,49.53 93.85,49.53 96.14,47.24 95,47.24 93.85,47.24 96.14,48.39 95,48.39 93.85,48.39 99.57,52.96 98.42,52.96 97.28,52.96 99.57,50.67 98.42,50.67 97.28,50.67 99.57,51.82 98.42,51.82 97.28,51.82 92.71,52.96 91.57,52.96 90.42,52.96 92.71,50.67 91.57,50.67 90.42,50.67 92.71,51.82 91.57,51.82 90.42,51.82 89.28,49.53 88.14,49.53 86.99,49.53 89.28,47.24 88.14,47.24 86.99,47.24 89.28,48.39 88.14,48.39 86.99,48.39 89.41,56.39 88.27,56.39 87.12,56.39 89.41,54.1 88.27,54.1 87.12,54.1 89.41,55.24 88.27,55.24 87.12,55.24 85.98,52.96 84.84,52.96 83.69,52.96 85.98,50.67 84.84,50.67 83.69,50.67 85.98,51.82 84.84,51.82 83.69,51.82 79.12,52.96 77.98,52.96 76.83,52.96 79.12,50.67 77.98,50.67 76.83,50.67 79.12,51.82 77.98,51.82 76.83,51.82 92.71,46.1 91.57,46.1 90.42,46.1 90.42,43.81 90.42,44.96 103,49.53 101.85,49.53 100.71,49.53 103,47.24 101.85,47.24 100.71,47.24 103,48.39 101.85,48.39 100.71,48.39 96.14,56.39 95,56.39 93.85,56.39 96.14,54.1 95,54.1 93.85,54.1 96.14,55.24 95,55.24 93.85,55.24 92.84,57.53 91.69,57.53 90.55,57.53 99.57,57.53 98.42,57.53 97.28,57.53 72.39,39.24 71.25,39.24 70.1,39.24 72.39,36.96 71.25,36.96 70.1,36.96 72.39,38.1 71.25,38.1 70.1,38.1 42.55,43.18 41.4,43.18 40.26,43.18 41.4,40.89 40.26,40.89 42.55,42.04 41.4,42.04 40.26,42.04 68.96,42.67 67.82,42.67 66.67,42.67 68.96,40.39 67.82,40.39 66.67,40.39 68.96,41.53 67.82,41.53 66.67,41.53 65.53,46.1 64.39,46.1 65.53,43.81 64.39,43.81 63.25,43.81 65.53,44.96 64.39,44.96 63.25,44.96 72.52,46.1 71.37,46.1 70.23,46.1 72.52,43.81 71.37,43.81 70.23,43.81 72.52,44.96 71.37,44.96 70.23,44.96 81.41,56.39 80.26,56.39 82.55,54.1 81.41,54.1 80.26,54.1 81.41,55.24 80.26,55.24 79.12,57.53 85.98,57.53 84.84,57.53 83.69,57.53 98.3,17.27 40.13,51.56 38.99,51.56 37.85,51.56 42.67,51.56 43.82,51.56 44.96,51.56 14.73,54.23 13.59,54.23 12.45,54.23 103,45.97 103,44.83 78.49,33.91 80.52,27.81 79.38,27.81 78.23,27.81 80.52,25.53 79.38,25.53 78.23,25.53 80.52,26.67 79.38,26.67 78.23,26.67 89.79,34.92 88.65,34.92 87.5,34.92 86.11,34.92 84.96,34.92 83.82,34.92 79.25,18.67 79.25,19.94 79.25,21.21 33.78,21.34 37.34,24.77 30.86,14.73 26.8,13.21 41.53,19.69 41.53,18.54 41.53,17.4 41.53,16.26 29.84,16 33.02,13.21 37.34,13.97 45.34,18.67 45.21,19.81 45.59,23.75 44.45,23.62 41.53,22.35 41.53,23.5 40.77,28.83 40.77,29.97 40.77,31.12 40.77,32.51 40.77,33.78 40.77,34.92 34.93,21.34 32.64,21.34 21.59,17.65 21.59,18.67 17.02,18.67 15.88,18.67 16.89,14.48 15.75,14.48 18.03,12.19 15.75,12.19 18.03,13.33 16.89,13.33 15.75,13.33 18.03,14.48 41.15,37.72 39.88,37.72 28.45,39.37 27.3,39.37 26.16,39.37 24.38,39.37 23.24,39.37 22.1,39.37 54.36,14.22 59.94,19.3 24.38,38.23 23.24,38.23 22.1,38.23 24.38,37.08 23.24,37.08 22.1,37.08 103,50.67 103,51.82 103,52.96 101.73,57.53 100.58,57.53 96.14,57.53 95,57.53 93.85,57.53 89.41,57.53 88.27,57.53 87.12,57.53 82.55,57.53 81.41,57.53 80.26,57.53 69.21,27.43 68.07,27.43 70.36,25.15 69.21,25.15 68.07,25.15 70.36,26.29 69.21,26.29 68.07,26.29 47.5,14.73 48.64,18.03 47.5,18.03 49.78,15.75 48.64,15.75 47.5,15.75 49.78,16.89 48.64,16.89 47.5,16.89 47.62,33.27 46.48,33.27 45.34,33.27 47.62,30.99 46.48,30.99 45.34,30.99 47.62,32.13 46.48,32.13 45.34,32.13 54.48,21.97 53.34,21.97 52.2,21.97 54.61,19.3 53.47,19.3 52.32,19.3 54.61,20.45 53.47,20.45 52.32,20.45 12.45,10.79 11.3,10.79 12.45,8.51 11.3,8.51 12.45,9.65 11.3,9.65 74.8,11.81 75.82,11.81 103.89,11.43 103.89,12.57 103.89,13.72 103.89,14.99 103.89,16.13 103.89,17.27 103.89,18.42 103.89,19.56 103.89,20.83 103.89,21.97 56.13,37.46 56.13,35.94 56.39,41.53 55.37,41.53 68.45,22.99 69.6,22.99 70.74,22.99 53.21,14.22 59.82,14.1 88.01,11.18 88.01,10.03 91.44,11.18 90.3,11.18 89.15,11.18 91.44,8.89 90.3,8.89 91.44,10.03 90.3,10.03 89.15,10.03 89.15,8.89 67.06,13.59 65.91,13.59 64.77,13.59 67.06,12.45 65.91,12.45 64.77,12.45 34.93,11.18 34.93,10.03 34.93,8.89 36.07,11.18 36.07,10.03 36.07,8.89 43.82,13.72 42.67,13.72 41.53,13.72 43.82,12.57 42.67,12.57 41.53,12.57 17.14,6.86 16,6.86 18.29,4.57 16,4.57 18.29,5.71 17.14,5.71 16,5.71 18.29,6.86 24.13,6.86 22.99,6.86 25.27,4.57 22.99,4.57 25.27,5.71 24.13,5.71 22.99,5.71 25.27,6.86 15.11,23.11 16,24.13 15.49,26.92 80.01,30.86 77.72,30.73 68.07,32.13 69.21,32.13 73.53,6.35 75.06,4.06 74.55,6.35 74.04,4.06
  pour Top (isolate 0.508): 107.06,0 107.06,60.58 0,60.58 0,0
  pour Bottom (isolate 0.508): 107.06,0 107.06,60.58 0,60.58 0,0
GPIO2
  Top 0.381: R62.2 28.96,53.21 29.21,52.96 29.21,52.83 30.35,51.69 34.67,51.69 35.94,50.42 35.94,47.88 35.43,47.37 34.16,47.37 ESP_ADAPTER.5
N$1  (via drill 0.61)
  Top 0.254: IC1.2 88.14,16.89 87.63,16.38 84.96,16.38 84.45,15.87 R1.2
  Top 0.305: v84.45,14.99 R1.2
  Top 0.381: R31.1 v77.85,15.87
  Bottom 0.305: v77.85,15.87 84.07,15.87 84.45,15.49 v84.45,14.99
N$2  (via drill 0.61)
  Top 0.254: C2.1 86.14,13.25 v86.61,13.46 | v82.55,13.46 82.59,13.33 R5.2
  Bottom 0.254: v86.61,13.46 v82.55,13.46
N$3
  Top 0.254: C1.2 C2.2 | C1.2 88.77,16.13 89.41,16.76 IC1.3 | C1.2 R2.2
N$4
  Top 0.254: R7.1 R6.1 93.47,15.62 91.95,17.14 IC1.5
N$5
  Top 0.254: R4.2 76.8,13.37 75.82,14.35 75.82,16.09 R31.2 75.86,16.93 75.95,17.02 77.22,17.02 77.47,17.27 77.47,18 C5.2
N$6  (via drill 0.61)
  Top 0.254: R16.1 v90.04,28.19
  Bottom 0.254: v90.04,28.19 90.04,24.13 88.14,22.23 U$4.2
N$7  (via drill 0.61)
  Top 0.254: R5.1 R4.1 80.39,21.97 79.12,23.24 77.4,23.24 D3.C D9.A | R5.1 82.55,15.62 83.82,16.89 86.36,16.89 86.87,17.4 IC1.1 | R6.2 v93.47,12.45 | v82.55,14.86 82.64,14.99 R5.1
  Bottom 0.254: v93.47,12.45 82.04,12.45 81.41,13.08 81.41,14.82 81.66,15.07 83.1,15.07 v82.55,14.86
N$8
  Top 0.305: C5.1 75.69,18.03 75.44,18.29 D9.C D3.A
N$9
  Top 0.254: R8.2 98.17,15.62 96.9,16.89 94.74,16.89 94.49,17.14 IC1.7 94.49,21.34 93.98,21.84 92.33,21.84 91.95,22.23 IC1.10
N$10
  Top 0.305: R19.2 82.46,19.85 U$4.1
N$11  (via drill 0.61)
  Top 0.254: IC1.13 v88.14,26.42 87.76,26.8 85.22,26.8 83.82,28.19 R14.2 | v94.23,29.97 R13.1
  Bottom 0.254: v88.14,26.42 88.14,28.96 89.92,30.73 93.09,30.73 v94.23,29.97
N$12  (via drill 0.61)
  Top 0.254: R11.2 C3.1 99.66,31.99 D1.A 99.62,32.08 v99.57,32.13 | v96.14,32.13 96.32,32.13 D5.A 96.1,32.04 R13.2
  Bottom 0.254: v99.57,32.13 v96.14,32.13
N$13
  Top 0.254: D1.C D2.A 97.92,36.32 97.66,36.58 92.58,36.58 91.57,35.56 91.57,33.4 91.44,33.27 | 91.44,33.27 91.57,33.27 92.2,32.64 92.2,26.42 93.22,25.4 IC1.9 | 91.44,33.27 U$3.3
N$14  (via drill 0.61)
  Top 0.254: R11.1 C3.2 v97.92,30.35 | v94.36,32.13 D6.C | v88.14,30.61 R12.2
  Bottom 0.254: v97.92,30.35 95.25,30.35 94.36,31.24 | 94.36,31.24 v94.36,32.13 | 94.36,31.24 88.52,31.24 v88.14,30.61
N$15
  Top 0.254: D5.C D6.A 93.27,34.98 92.71,34.42 92.71,27.05 94.49,25.27 IC1.8
N$16
  Top 0.254: IC1.12 89.41,26.67 88.14,27.94 R12.1 R18.1
N$17
  Top 0.254: IC1.14 86.87,25.78 86.36,26.29 84.96,26.29 83.57,27.69 82.42,27.69 82.04,28.07 R15.2 82.97,28.87 83.06,28.96 83.06,30.48 83.18,30.61 84.03,30.61 R14.1
N$18  (via drill 0.61)
  Top 0.254: R18.2 85.56,30.57 85.22,30.23 85.22,28.07 v85.6,27.69
  Bottom 0.254: v85.6,27.69 86.11,27.18 86.11,24.77 85.72,24.38 82.68,24.38 U$4.3
N$19
  Top 0.254: IC5.5 58.42,23.24 IC2.5
  Bottom 0.254: U$5.3 47.37,24.51 53.21,24.51 53.59,24.13 IC2.5
N$20  (via drill 0.61)
  Top 0.254: IC5.6 59.69,23.75 IC2.6 | R22.2 v56.39,26.67 | v65.79,21.97 66.04,22.23 66.04,22.86 67.31,24.13 71.88,24.13 73.24,25.49 R20.1
  Bottom 0.254: v65.79,21.97 62.23,21.97 IC2.6 60.07,25.91 58.8,27.18 56.9,27.18 v56.39,26.67
N$21  (via drill 0.61)
  Top 0.254: IC5.2 v60.96,30.1 IC2.2 | R9.1 v56.01,30.86 | R10.2 73.24,30.65 v73.28,30.86 73.24,30.57 C6.1
  Bottom 0.254: v56.01,30.86 56.52,30.86 57.28,30.1 v60.96,30.1 | v73.28,30.86 73.28,30.35 73.15,30.23 70.74,30.23 70.36,30.61 63.75,30.61 IC2.2
N$22  (via drill 0.61)
  Top 0.254: IC5.1 62.23,28.83 IC2.1 | R10.1 v71.25,31.12 | 71.5,29.43 C6.2
  Top 0.381: R10.1 C6.2 R20.2
  Bottom 0.254: v71.25,31.12 65.79,31.12 IC2.1
N$23  (via drill 0.61)
  Top 0.254: IC5.7 60.96,23.11 61.98,24.13 IC2.7 | v55.88,28.96 R23.2 55.63,28.79 55.63,27.94 55.37,27.69 54.1,27.69 53.89,27.47 R22.1
  Bottom 0.254: v55.88,28.96 60.83,28.96 62.61,27.18 IC2.7
N$24
  Top 0.254: IC5.3 59.69,31.37 IC2.3
  Bottom 0.381: X1.1 90.17,41.66 89.92,41.66 90.42,41.15 90.42,37.21 89.41,36.2 82.93,36.2 79.63,32.89 76.2,32.89 75.95,33.15 60.58,33.15 60.07,32.64 IC2.3
N$25
  Top 0.254: LED3.5 R17.2
N$26
  Top 0.254: LED3.6 97.8,39.57 R21.2
N$27
  Top 0.381: R28.2 LED2.5
N$28
  Top 0.381: R29.2 18.32,44.96 LED2.6
N$29
  Top 0.381: R30.2 18.32,41.66 LED2.4
N$30
  Top 0.254: LED3.4 97.29,42.97 R24.2
N$31
  Top 0.381: LED1.5 58,35.81 R25.2
N$32
  Top 0.381: LED1.6 57.92,34.11 R26.2
N$33
  Top 0.381: LED1.4 57.95,37.51 R27.2
N$36
  Top 0.254: Q1.3 57.66,2.54 58.04,2.16 D12.A
  Top 0.381: SG2.- 59.18,3.3 58.8,2.92 D12.A
N$37  (via drill 0.61)
  Top 0.254: IC3.2 26.8,18.03 R37.2 v26.8,14.86 | R3.2 v21.46,16.26
  Bottom 0.254: v26.8,14.86 26.8,15.75 26.67,15.87 21.84,15.87 v21.46,16.26
N$38  (via drill 0.61)
  Top 0.254: C11.2 30.06,13.12 29.72,13.46 29.72,14.73 29.59,14.86 28.74,14.86 | 28.74,14.86 C12.2 | 28.74,14.86 28.74,18.63 IC3.3 | v37.34,15.75 R38.2 37.34,15.33
  Bottom 0.254: IC3.3 30.86,16.51 36.58,16.51 v37.34,15.75
N$39
  Top 0.254: R40.2 R3.1 C15.2
N$40  (via drill 0.61)
  Top 0.254: 23.24,18.8 R40.1 R41.1 25.02,14.95 v24.89,14.6 | 23.24,18.8 IC3.1 | R42.2 v35.05,13.08 | 23.24,18.8 23.24,19.69 22.73,20.19 19.89,20.19 D23.C D24.A
  Bottom 0.254: 24.89,14.1 v24.89,14.6 24.89,12.83 25.53,12.19 34.16,12.19 v35.05,13.08
N$41
  Top 0.254: C12.1 28.7,12.06 28.32,11.68 25.4,11.68 24.89,12.19 R41.2
N$42
  Top 0.254: IC3.5 35.05,17.4 R42.1 R43.1
N$43
  Top 0.381: 33.53,27.05 IC3.10 33.53,24.89 35.05,23.37 37.47,23.37 38.61,22.23 IC3.7 39.62,17.91 R44.2
N$44  (via drill 0.61)
  Top 0.254: R48.2 25.53,32.13 v24.89,32.77 | v28.32,36.32 28.32,36.2 29.21,35.31 32.39,35.31 32.77,34.92 32.77,34.8 | 32.77,34.8 D19.A | 32.77,34.8 33.02,35.05 36.07,35.05 36.45,34.67 D17.A 36.66,33.51 C13.1 R46.2
  Bottom 0.203: 24.64,33.02 24.64,35.81
  Bottom 0.254: v24.89,32.77 24.64,33.02 | 24.64,35.81 25.27,36.45 28.19,36.45 v28.32,36.32
N$45  (via drill 0.61)
  Top 0.254: v21.46,22.99 16.89,22.99 15.49,21.59 15.49,20.45 v15.37,20.19 | D18.A D17.C 37.79,36.63 38.1,36.32 38.1,28.58 IC3.9
  Bottom 0.254: U$7.3 v15.37,20.19 | v21.46,22.99 22.86,22.99 24.13,24.26 34.67,24.26 36.07,25.65 IC3.9
N$46
  Top 0.254: D20.C 30.99,32.89 31.24,32.64 33.4,32.64 | 33.4,32.64 33.4,31.54 R47.2 33.49,31.62 C13.2 R46.1 | D18.C 34.54,32.89 34.29,32.64 33.4,32.64
N$47
  Top 0.254: D20.A D19.C 32.77,37.59 33.27,38.1 37.59,38.1 38.61,37.08 IC3.8
N$48
  Top 0.254: 25.53,27.05 R48.1 24.73,29.63 24.38,29.97 24.38,30.99 24.13,31.24 23.33,31.24 R49.2
  Top 0.381: IC3.13 25.91,26.67 25.53,27.05
N$49
  Top 0.254: 27.56,28.45 30.48,28.45 31.62,29.59 31.62,31.46 R47.1
  Top 0.381: IC3.12 28.45,26.8 27.56,27.69 27.56,28.45 R52.1
N$50
  Top 0.254: R50.2 R49.1 23.24,26.67 IC3.14
N$51
  Top 0.254: D24.C D23.A C15.1
N$52
  Top 0.254: R53.1 29.97,32.77 29.08,33.65 23.62,33.65 23.37,33.91 U$8.2
N$53  (via drill 0.61)
  Top 0.254: R54.2 20.57,21.84 v20.45,21.97
  Bottom 0.254: v20.45,21.97 20.07,22.23 19.68,22.61 19.68,33.91 U$8.1
N$54  (via drill 0.61)
  Top 0.254: R52.2 v27.56,31.37
  Bottom 0.254: v27.56,31.37 27.56,34.29 26.8,35.05 U$8.3
N$55
  Top 0.61: D13.C 55.81,57.96 POWER.8
N$62
  Top 0.381: R61.1 23.98,48.77 S1.2
N$63
  Top 0.381: S2.2 23.98,53.21 R62.1 R71.2
N$64
  Top 0.381: R63.1 LED.C
N$68
  Top 0.254: U$1.1 51.94,17.91 Q7.1
N$69
  Top 0.254: U$1.2 53.21,16.64 Q7.2
N$72  (via drill 0.61)
  Top 0.254: v58.67,15.37 U$1.3
  Bottom 0.254: G1.+ 68.46,19.19 68.2,18.92 66.42,18.92 63.75,16.26 59.56,16.26 v58.67,15.37
PA1  (via drill 0.61)
  Top 0.254: v11.81,14.48 R70.2 | XIO.4 2.3,12.31 JP8.2
  Bottom 0.254: JP8.2 2.29,12.7 3.17,13.59 11.68,13.59 11.81,13.72 v11.81,14.48
PB4  (via drill 0.61)
  Top 0.203: 78.23,3.68 76.2,3.68
  Top 0.254: LED3.2 102.36,41.27 101.73,40.64 101.73,7.62 100.58,6.48 v100.33,6.48 | JP6.8 64.9,9.68 64.9,8.13 66.17,6.86 71.37,6.86 72.9,5.33 72.9,3.56 73.79,2.67 75.18,2.67 76.2,3.68 | 78.23,3.68 U$6.14
  Bottom 0.203: 80.26,3.68 90.55,3.68 90.93,4.06 90.93,5.59
  Bottom 0.254: v100.33,6.48 91.82,6.48 90.93,5.59 | U$6.14 79.5,4.45 80.26,3.68
PB5  (via drill 0.61)
  Top 0.254: 67.56,10.41 67.56,9.8 JP6.7 67.56,9.75 67.56,8.13 68.2,7.37 81.41,7.37 82.04,6.73 U$6.12 | LED1.1 65.44,34.16 68.33,34.16 68.96,33.53 73.91,33.53 74.68,32.77 74.68,26.16 72.52,24 72.52,16.38 v70.36,14.22
  Bottom 0.254: v70.36,14.22 67.56,11.43 67.56,9.8 JP6.7 67.56,9.75
PB6  (via drill 0.61)
  Top 0.203: 85.34,3.68 88.01,3.68
  Top 0.254: LED1.2 65.52,35.94 67.31,35.94 69.21,34.04 74.17,34.04 75.18,33.02 75.18,25.78 73.02,23.62 73.02,16.13 72.14,15.24 72.14,13.46 v71.75,13.08 72.64,12.19 73.66,12.19 74.3,12.83 79.12,12.83 79.5,12.45 83.18,12.45 88.39,7.24 88.39,4.06 88.01,3.68 | 70.1,9.75 JP6.6 | U$6.10 84.58,4.45 85.34,3.68
  Bottom 0.254: v71.75,13.08 69.98,11.3 69.98,9.88 JP6.6 70.1,9.75
PB7  (via drill 0.61)
  Top 0.254: LED1.3 65.6,37.72 66.8,37.72 69.98,34.54 74.55,34.54 75.69,33.4 75.69,25.53 73.53,23.37 73.53,15.87 72.64,14.99 72.64,13.84 v73.02,13.21
  Bottom 0.254: v73.02,13.21 73.02,10.18 JP6.5
PE0
  Top 0.254: 38.08,9.78 PWML.1 37.59,9.3 U$2.16
PE1
  Top 0.254: 40.64,9.78 PWML.2
  Bottom 0.254: U$2.14 40.13,5.46 40.89,6.22 40.89,9.52 PWML.2
PE4
  Bottom 0.254: U$2.12 41.66,4.95 41.4,5.21 41.4,8.03 PWML.3
PH5  (via drill 0.61)
  Top 0.254: LED3.3 103.67,42.93 105.41,42.93 105.79,42.54 105.79,38.99 102.74,35.94 102.74,9.4 v103.63,8.51
  Bottom 0.254: v103.63,8.51 100.2,8.51 99.57,7.87 77.98,7.87 76.33,6.22 75.95,6.22 74.8,5.08 63.25,5.08 60.45,7.87 60.45,9.25 JP6.10
PH6  (via drill 0.61)
  Top 0.254: v102.23,6.73 102.23,37.94 LED3.1 | JP6.9 62.48,9.75 62.48,8 64.13,6.35 71.12,6.35 72.39,5.08 72.39,2.54 73.28,1.78 v74.42,1.78
  Bottom 0.254: v102.23,6.73 101.98,6.6 101.09,7.49 99.95,7.49 99.82,7.37 78.36,7.37 77.09,6.1 77.09,5.08 U$6.16 76.96,3.81 76.83,3.68 76.2,3.68 74.8,2.29 74.8,2.16 v74.42,1.78
PH_OUT  (via drill 0.61)
  Top 0.254: 52.5,28.58 D10.A
  Top 0.381: v50.29,31.5 D4.C D10.A 52.5,28.83 R23.1
  Bottom 0.381: ADCL.2 48.27,34.53 50.29,32.51 v50.29,31.5
PL1  (via drill 0.61)
  Top 0.254: v13.46,45.09 13.14,45.34 LED2.1
  Bottom 0.254: XIO.29 12.94,45.33 v13.46,45.09
PL3  (via drill 0.61)
  Top 0.254: v13.46,43.31 LED2.2
  Bottom 0.254: XIO.27 7.99,42.79 8.51,43.31 v13.46,43.31
PL5  (via drill 0.61)
  Top 0.254: v13.46,41.66 13.43,41.66 LED2.3
  Bottom 0.254: XIO.25 7.73,40.25 9.14,41.66 v13.46,41.66
PWM1
  Bottom 0.254: PWML.8 55.88,9.78 55.88,8.64 55.12,7.87 50.29,7.87 49.02,6.6 49.02,3.43 48.01,2.41 U$2.7
PWM2
  Top 0.203: 46.48,5.71 46.48,3.68
  Top 0.254: 45.47,2.41 U$2.9 46.48,3.68 | PWML.7 49.89,6.35 47.12,6.35 46.48,5.71
PWM3
  Top 0.203: 43.94,3.43 43.94,5.71
  Top 0.254: 50.8,9.78 PWML.6 47.85,6.86 45.09,6.86 43.94,5.71 | U$2.11 42.93,2.41 43.94,3.43
PWM4
  Top 0.203: 41.4,5.59 41.4,3.43
  Top 0.254: 48.26,9.78 PWML.5 45.82,7.37 44.83,7.37 43.69,6.22 42.04,6.22 41.4,5.59 | U$2.13 40.39,2.41 41.4,3.43
PWM5
  Top 0.203: 41.15,6.22 39.5,6.22 38.86,5.59 38.86,3.3
  Top 0.254: Q1.1 58.61,11.5 57.91,12.19 46.1,12.19 45.59,11.68 45.59,9.91 PWML.4 45.72,9.78 45.72,8.38 45.21,7.87 44.58,7.87 43.43,6.73 41.66,6.73 41.15,6.22 | U$2.15 37.97,2.41 38.86,3.3
RESET  (via drill 0.61)
  Top 0.254: S3.A2 72.55,42.2 73.41,43.05 73.41,54.61 v72.39,55.63
  Bottom 0.254: v72.39,55.63 69.47,55.63 68.58,56.52 68.58,58.01 POWER.3
RST
  Top 0.381: ESP_ADAPTER.4 29.08,44.7 28.07,45.72 28.07,48.73 R61.2
RX
  Bottom 0.381: ESP_ADAPTER.1 34.04,41.66 33.02,40.64 21.59,40.64 19.05,38.1 19.05,16.13 22.86,12.32 22.86,9.78 COMMUNICATION.4
SCL
  Bottom 0.254: 15.24,9.78 COMMUNICATION.1
SCL1  (via drill 0.61)
  Top 0.254: 68.33,17.74 v68.33,17.65 R68.2 | v62.1,15.37 U$1.6 | 82.68,9.88 JP6.1 84.33,9.78 85.72,8.38 v85.72,6.35
  Bottom 0.254: JP6.1 82.68,9.88 82.68,10.54 80.14,13.08 80.14,13.21 78.49,14.86 75.95,14.86 72.64,18.16 69,18.16 68.45,17.61 68.36,17.61 v68.33,17.65 | v68.33,17.65 68.33,17.53 | v68.33,17.65 68.33,17.91 67.94,18.16 66.42,18.16 63.63,15.37 v62.1,15.37 | U$6.15 77.47,2.41 78.23,3.17 78.23,6.22 78.87,6.86 84.84,6.86 v85.72,6.35
SDA1  (via drill 0.61)
  Top 0.203: 79.76,3.68 82.68,3.68
  Top 0.254: v66.93,17.27 R69.2 | U$1.5 v63.12,14.1 | 80.26,9.68 JP6.2 83.31,6.71 83.31,4.32 82.68,3.68 | U$6.13 79.5,3.43 79.76,3.68
  Bottom 0.254: JP6.2 80.26,9.8 80.26,11.81 79.5,12.57 79.38,12.57 77.6,14.35 75.69,14.35 72.39,17.65 70.23,17.65 69.34,16.76 66.93,16.76 | 66.93,16.76 v66.93,17.27 | v63.12,14.1 63.75,14.1 64.39,14.73 64.39,15.37 65.79,16.76 66.93,16.76
TX
  Bottom 0.381: ESP_ADAPTER.8 30.73,49.78 27.81,46.86 27.81,43.43 25.91,41.53 21.46,41.53 18.29,38.35 18.29,15.87 20.57,13.59 20.45,9.88 COMMUNICATION.3
V+  (via drill 0.61, 0.81)
  Top 0.381: IC1.4 90.68,20.57 89.66,21.59 85,21.59 85.22,21.8 v85.22,25.4 | v57.53,47.62 57.53,40.64 59.05,39.12 62.1,39.12 63.37,37.85 63.37,33.78 64.26,32.89 66.17,32.89 66.93,32.13 v66.93,29.59 66.93,24.77 66.29,24.13 IC2.8 65.15,22.99 63.95,21.78 IC5.8 62.23,20.07 v61.72,19.56 | v57.66,50.16 57.66,51.94 v55.63,53.97
  Top 0.61: 52.83,53.85 45.59,53.85 43.82,55.63 11.81,55.63 9.78,53.59 9.78,28.32 v10.79,27.3 9.78,26.29 v9.78,12.45 | 52.83,53.85 55.25,53.85 55.37,53.97 v55.63,53.97 | 52.83,55.3 D13.A 52.91,53.92 52.83,53.85 | IC3.4 30.99,22.23 29.84,23.37 25.78,23.37 | v17.02,25.53 18.41,24.13 22.1,24.13 22.86,23.37 25.78,23.37 | R54.1 25.74,23.28 25.78,23.37 | 85,21.59 R19.1 | v42.42,7.62 39.75,7.62 v39.37,7.49 | U$2.8 U$2.6
  Bottom 0.381: v57.53,47.62 57.53,50.04 v57.66,50.16 | v85.22,25.4 85.22,25.78 81.41,29.59 70.48,29.59 70.1,29.97 67.31,29.97 v66.93,29.59
  Bottom 0.61: v10.79,27.3 12.83,27.3 14.61,25.53 v17.02,25.53 | U$2.8 47.75,7.11 47.24,7.62 v42.42,7.62 | v39.37,7.49 35.05,7.49 30.35,2.79 12.83,2.79 9.78,5.84 v9.78,12.45
  Bottom 0.813: 78.61,58.93 73.79,54.1 v55.63,53.97
V-  (via drill 0.61)
  Top 0.254: R53.2 29.76,29.63 v29.72,29.59 | IC5.4 v58.42,26.29
  Top 0.381: v44.58,40 v54.1,40 54.1,33.53 55.12,32.51 57.15,32.51 57.53,32.13 IC2.4 58.42,30.86 IC5.4 | IC1.11 90.68,25.65 91.57,26.54 91.57,31.37 91.06,31.88 89.79,31.88 | 89.79,31.88 82.68,31.88 79.38,35.18 70.23,35.18 65.41,40 59.94,40 v59.69,40.26 | R16.2 90.04,31.62 89.79,31.88
  Bottom 0.254: 51.56,5.84 51.56,4.06
  Bottom 0.381: IC3.11 30.99,27.3 29.72,28.58 v29.72,29.59 29.72,38.61 30.1,38.99 43.56,38.99 v44.58,40 | v59.69,40.26 54.36,40.26 v54.1,40 | v58.42,26.29 58.42,25.4 58.8,25.02 58.8,18.16 57.4,16.76 57.4,8.51 56.13,7.24 52.45,7.24 51.56,6.35 51.56,5.84 | 51.56,4.06 51.56,3.68 U$2.5